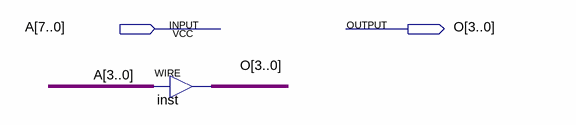
[diagram p0: schematic sheet]
// Quartus schematic g27_8bit_to_4bit_converter.bdf as structural Verilog: 1 symbols, 2 pins
module g27_8bit_to_4bit_converter (
  input  [7:0] A,
  output [3:0] O
);

  assign O = A[3:0];  // WIRE inst
endmodule
